# EAGLE design esquematico_trampa (EAGLE 8.0.1)
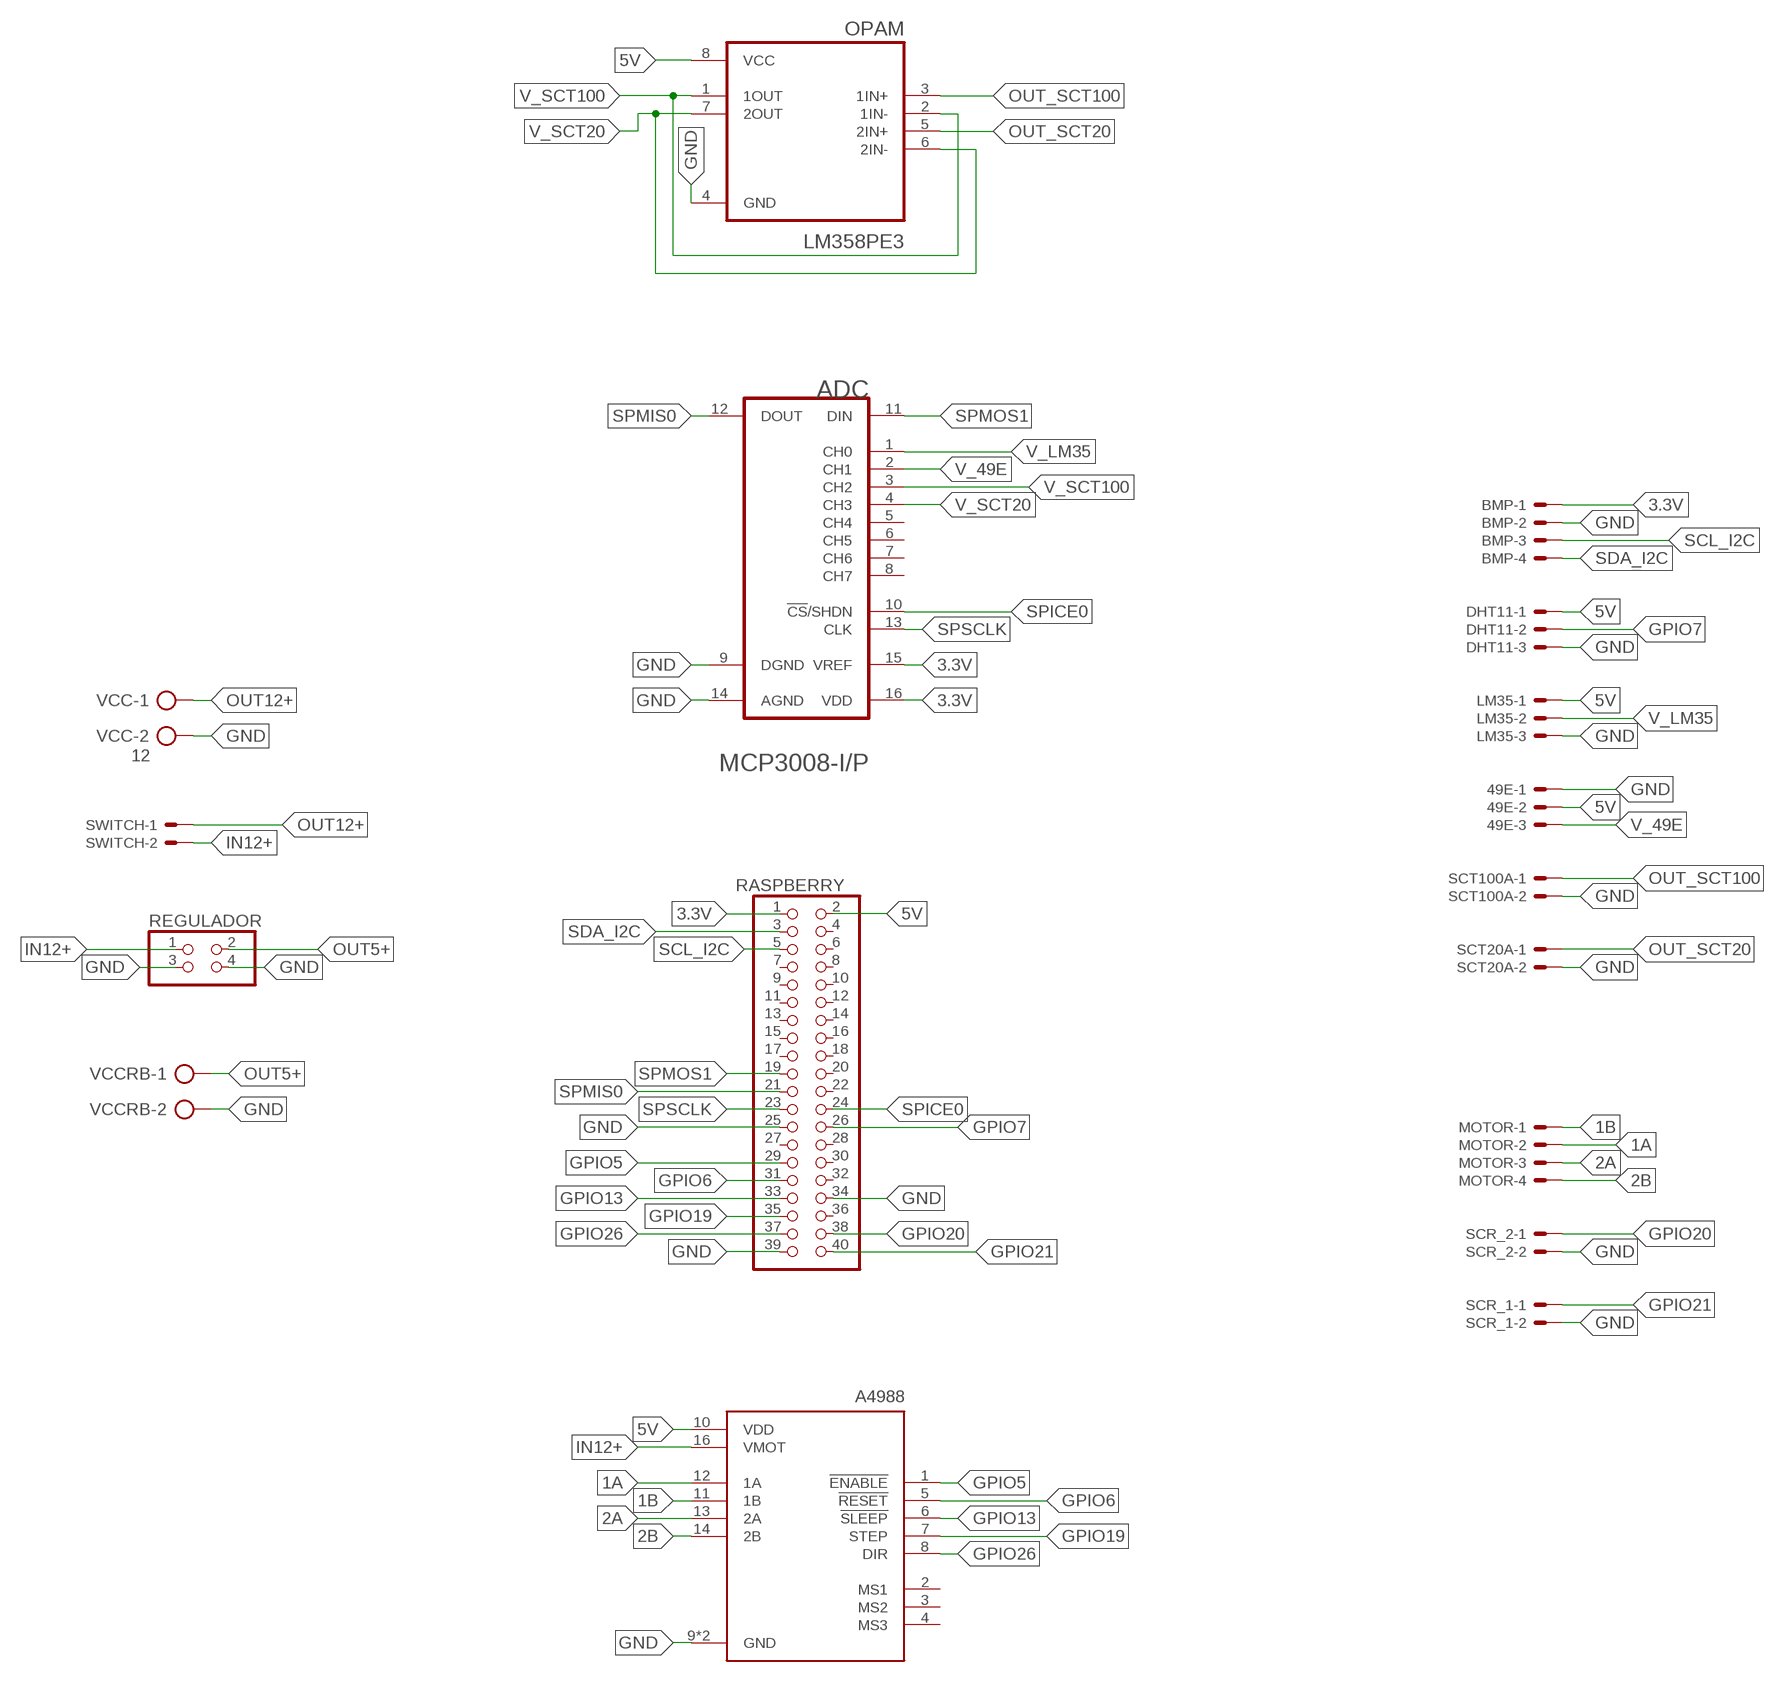
[diagram p0: schematic, sheet 1]

## Parts
49E  22-23-2031  [22-23-2031]
A4988  A4988_STEPPER_MOTOR_DRIVER_CARRIER  [MODULE_A4988_STEPPER_MOTOR_DRIVER_CARRIER]
ADC  MICROCHIP_MCP3008-I-PMICROCHIP_MCP3008-I-P_0_0  [MICROCHIP_MCP3008-I-P_0]
BMP  22-23-2041  [22-23-2041]
DHT11  22-23-2031  [22-23-2031]
LM35  22-23-2031  [22-23-2031]
MOTOR  22-23-2041  [22-23-2041]
OPAM  LM358PE3  [DIP794W45P254L959H508Q8]
RASPBERRY  PINHD-2X20  [2X20]
REGULADOR  PINHD-2X2  [2X02]
SCR_1  22-23-2021  [22-23-2021]
SCR_2  22-23-2021  [22-23-2021]
SCT20A  22-23-2021  [22-23-2021]
SCT100A  22-23-2021  [22-23-2021]
SWITCH  22-23-2021  [22-23-2021]
VCC  12  AK500/2-H  [AK500/2-H]
VCCRB  AK500/2-H  [AK500/2-H]

## Nets
1A: A4988.12(1A) MOTOR.2
1B: A4988.11(1B) MOTOR.1
2A: A4988.13(2A) MOTOR.3
2B: A4988.14(2B) MOTOR.4
3.3V: ADC.15(VREF) ADC.16(VDD) BMP.1 RASPBERRY.1
5V [VCC]: 49E.2 A4988.10(VDD) DHT11.1 LM35.1 OPAM.8(VCC) RASPBERRY.2
GND [VCC]: 49E.1 A4988.9(GND) A4988.15(GND) ADC.9(DGND) ADC.14(AGND) BMP.2 DHT11.3 LM35.3 OPAM.4(GND) RASPBERRY.25 RASPBERRY.34 RASPBERRY.39 REGULADOR.3 REGULADOR.4 SCR_1.2 SCR_2.2 SCT20A.2 SCT100A.2 VCC.2 VCCRB.2
GPIO5: A4988.1(!ENABLE) RASPBERRY.29
GPIO6: A4988.5(!RESET) RASPBERRY.31
GPIO7: DHT11.2 RASPBERRY.26
GPIO13: A4988.6(!SLEEP) RASPBERRY.33
GPIO19: A4988.7(STEP) RASPBERRY.35
GPIO20: RASPBERRY.38 SCR_2.1
GPIO21: RASPBERRY.40 SCR_1.1
GPIO26: A4988.8(DIR) RASPBERRY.37
IN12+ [VCC]: A4988.16(VMOT) REGULADOR.1 SWITCH.2
OUT5+ [VCC]: REGULADOR.2 VCCRB.1
OUT12+ [VCC]: SWITCH.1 VCC.1
OUT_SCT20: OPAM.5(2IN+) SCT20A.1
OUT_SCT100: OPAM.3(1IN+) SCT100A.1
SCL_I2C: BMP.3 RASPBERRY.5
SDA_I2C: BMP.4 RASPBERRY.3
SPICE0: ADC.10(!CS!/SHDN) RASPBERRY.24
SPMIS0: ADC.12(DOUT) RASPBERRY.21
SPMOS1: ADC.11(DIN) RASPBERRY.19
SPSCLK: ADC.13(CLK) RASPBERRY.23
V_49E: 49E.3 ADC.2(CH1)
V_LM35: ADC.1(CH0) LM35.2
V_SCT20: ADC.4(CH3) OPAM.6(2IN-) OPAM.7(2OUT)
V_SCT100: ADC.3(CH2) OPAM.1(1OUT) OPAM.2(1IN-)
Unconnected: A4988.2(MS1) A4988.3(MS2) A4988.4(MS3) ADC.5(CH4) ADC.6(CH5) ADC.7(CH6) ADC.8(CH7) RASPBERRY.4 RASPBERRY.6 RASPBERRY.7 RASPBERRY.8 RASPBERRY.9 RASPBERRY.10 RASPBERRY.11 RASPBERRY.12 RASPBERRY.13 RASPBERRY.14 RASPBERRY.15 RASPBERRY.16 RASPBERRY.17 RASPBERRY.18 RASPBERRY.20 RASPBERRY.22 RASPBERRY.27 RASPBERRY.28 RASPBERRY.30 RASPBERRY.32 RASPBERRY.36

## Library data of the parts
49E DHT11 LM35 = con-molex:22-23-2031: .100" (2.54mm) Center Header - 3 Pin; MF: MOLEX; MPN: 22-23-2031; OC_FARNELL: 1462950; OC_NEWARK: 30C0862
A4988 = A4988_STEPPER_MOTOR_DRIVER_CARRIER:A4988_STEPPER_MOTOR_DRIVER_CARRIER: Stepper motor controler; IC: A4988; 1A; Uin mot: 8÷35V Check availability <https://pricing.snapeda.com/parts/A4988%20STEPPER%20MOTOR%20DRIVER%20CARRIER/Pololu/view-part?ref=eda>; AVAILABILITY: Not in stock; DESCRIPTION: Stepper Motor Driver; MF: Pololu; MP: A4988 STEPPER MOTOR DRIVER CARRIER; PACKAGE: None; PRICE: None
ADC = P:MICROCHIP_MCP3008-I-P: CON-ADC-MCP3008-16; CIIVA_IDS: 1029167; CODE__JEDEC: MS-001-BB; COMPONENT_LINK_1_DESCRIPTION: Manufacturer URL; COMPONENT_LINK_1_URL: http://www.microchip.com/; COMPONENT_LINK_3_DESCRIPTION: Package Specification; COMPONENT_LINK_3_URL: http://www.microchip.com/stellent/groups/techpub_sg/documents/packagingspec/en012702.pdf; DATASHEET: http://ww1.microchip.com/downloads/en/DeviceDoc/21295d.pdf; DATASHEET_VERSION: revD, Dec-2008; FOOTPRINT_VARIANT_NAME_0: Manufacturer Recommended; IMPORTED: yes; IMPORTED_FROM: vault; IMPORT_TS: 1521858609; MF: Microchip; MPN: MCP3008-I/P; PACKAGE: PDIP300-P16; PACKAGE_DESCRIPTION: 16-Lead Plastic Dual In-Line (P) - 300 mil Body [PDIP]; PACKAGE_VERSION: revBB, Aug-2009; PIN_0_0_4_INSIDE_EDGE: clock; PREFIX: U; RELEASE_DATE: 1331947901; VAULT_GUID: 2915DD49-D9E5-42B8-8D13-7AC3BE91A6A7; VAULT_REVISION: 766F0992-63B6-4F6C-8EA7-A406CB97F150
BMP MOTOR = con-molex:22-23-2041: .100" (2.54mm) Center Header - 4 Pin; MF: MOLEX; MPN: 22-23-2041; OC_FARNELL: 1462920; OC_NEWARK: 38C0355
OPAM = LM358PE3:LM358PE3: Check availability <https://pricing.snapeda.com/parts/LM358PE3/Texas%20Instruments/view-part?ref=eda>; AVAILABILITY: In Stock; DESCRIPTION: Dual, 30-V, 700-kHz operational amplifier; MF: Texas Instruments; MP: LM358PE3; PACKAGE: PDIP-8 Texas; PRICE: None; PURCHASE-URL: https://pricing.snapeda.com/search/part/LM358PE3/?ref=eda
RASPBERRY = pinhead:PINHD-2X20: PIN HEADER
REGULADOR = pinhead:PINHD-2X2: PIN HEADER
SCR_1 SCR_2 SCT20A SCT100A SWITCH = con-molex:22-23-2021: .100" (2.54mm) Center Header - 2 Pin; MF: MOLEX; MPN: 22-23-2021; OC_FARNELL: 1462926; OC_NEWARK: 25C3832
VCC VCCRB = con-ptr500:AK500/2-H: CONNECTOR Aug. 2004 / PTR Meßtechnik: Die Bezeichnung der Serie AK505 wurde geändert. Es handelt sich hierbei um AK500 in horizontaler Ausführung.; OC_FARNELL: unknown; OC_NEWARK: unknown

## Net classes
0 Raspberry gpio: width 0.508 mm, drill 0.254 mm, clearance 0.254 mm
1 VCC: width 1.016 mm, drill 0.254 mm, clearance 0.254 mm

## Board
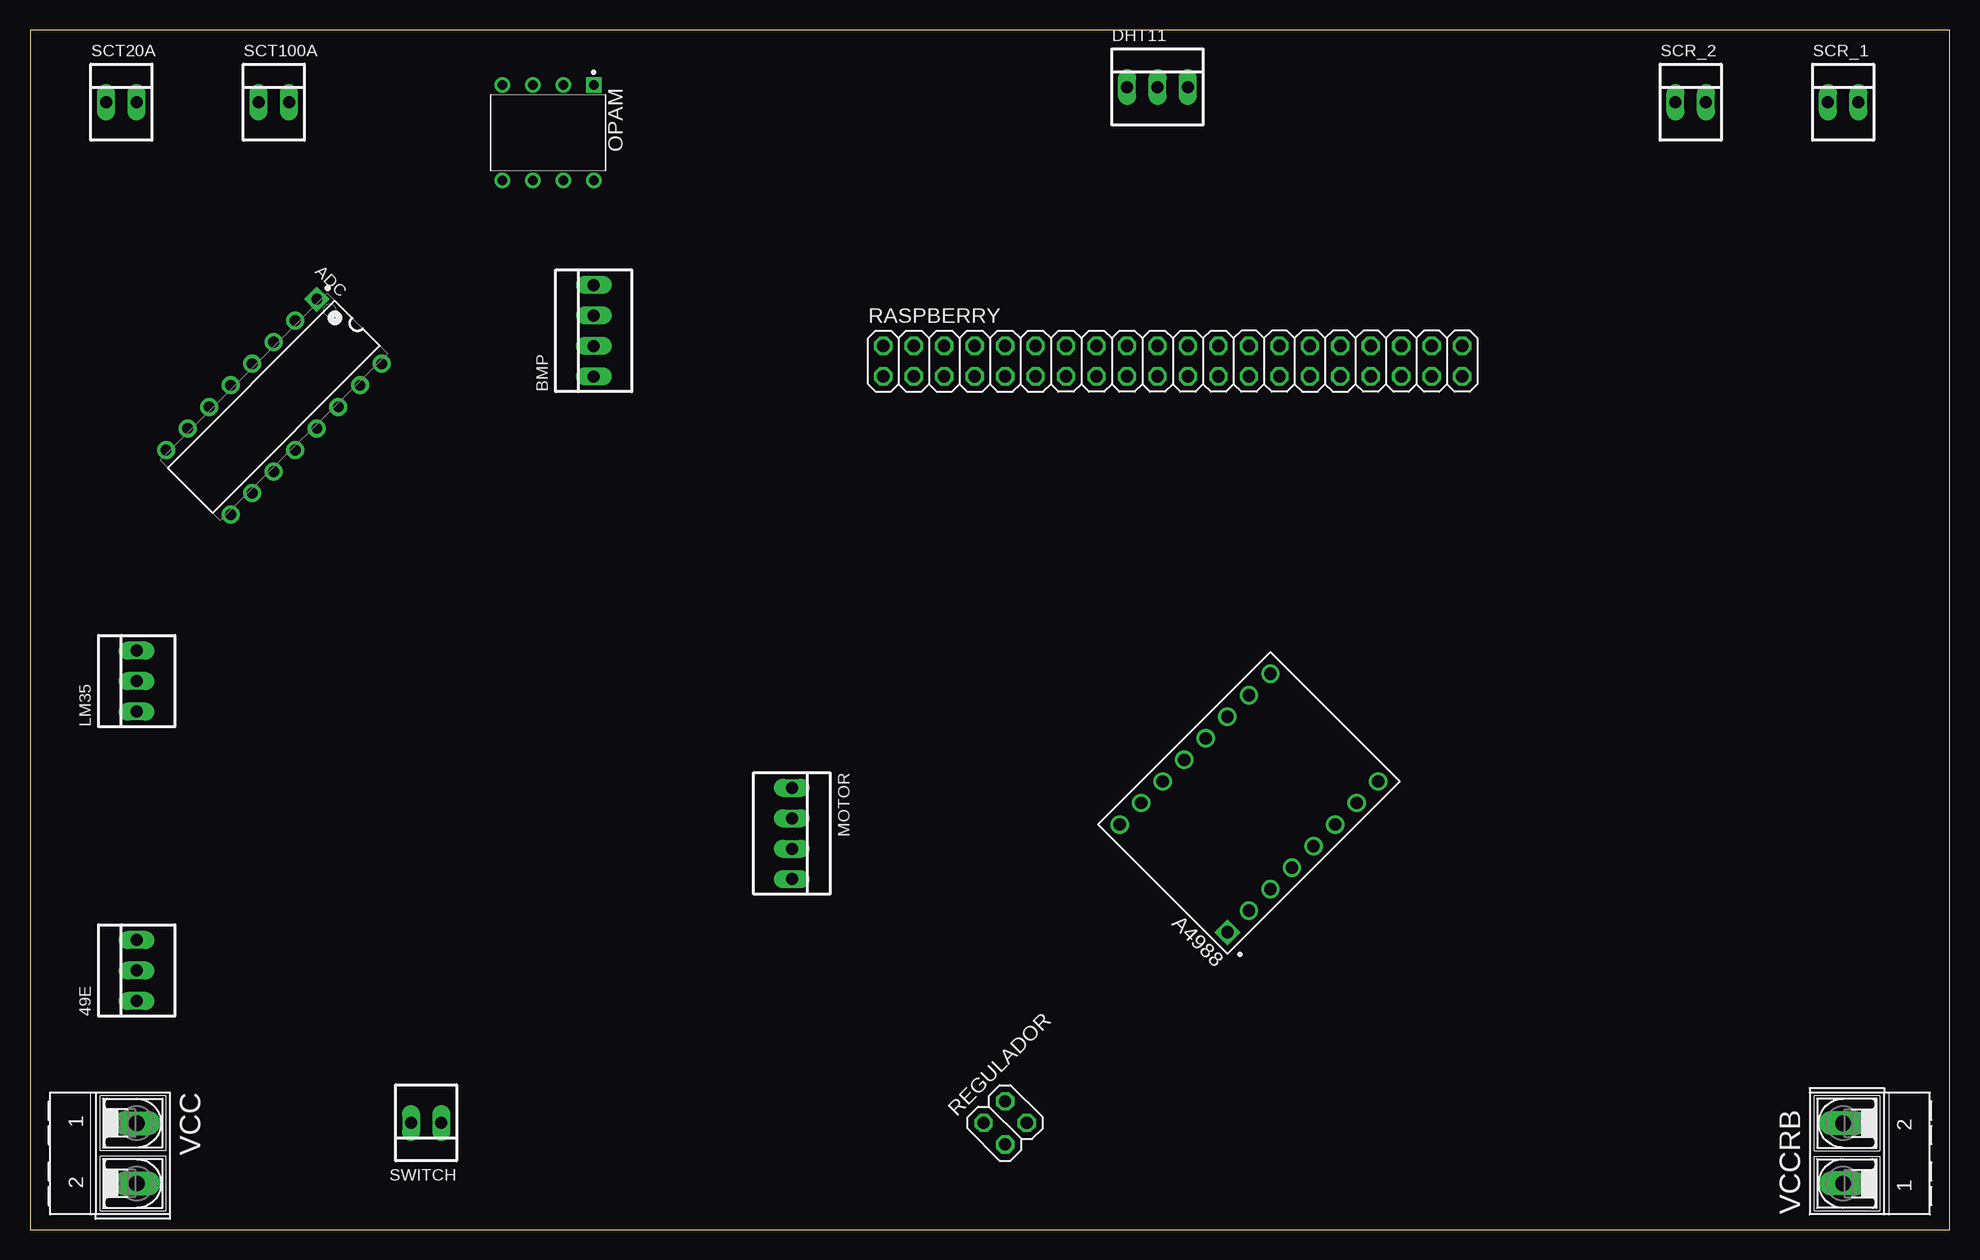
[diagram p1: board, top side]
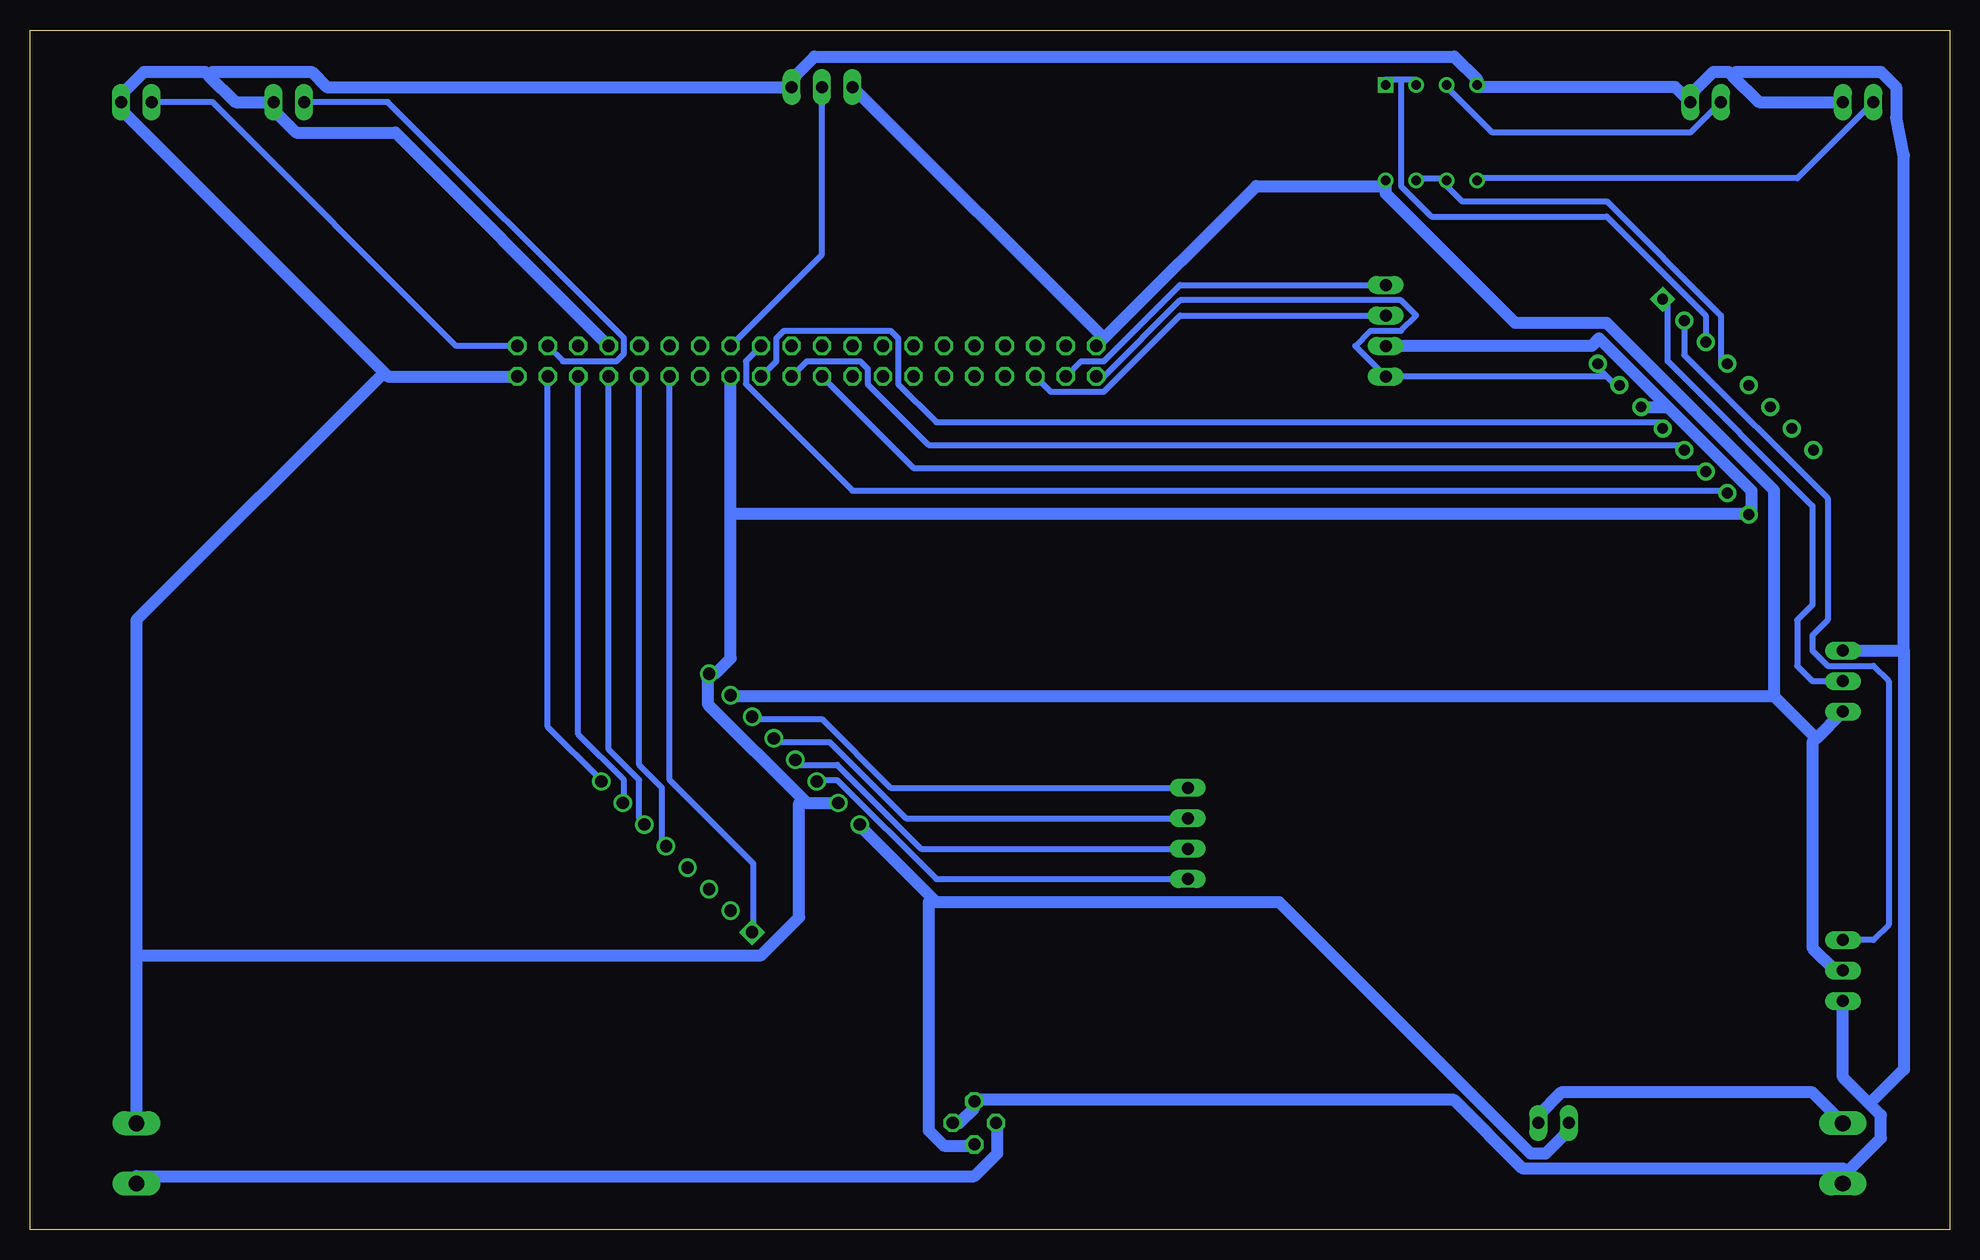
[diagram p2: board, bottom side, seen from below]

Size 160 x 100 mm. Coordinates in mm from the lower left corner, seen from the top.
Outline: 0,0 160,0 160,100 0,100 0,0
Copper layers (1*16): Top 0.035mm / dielectric 1.5mm / Bottom 0.035mm
Design rules "default": minimum track width 10mil, minimum drill 24mil, track to track 8mil, track to pad 8mil, pad to pad 8mil, via to via 8mil, smd to smd 8mil, copper to edge 40mil, drill to drill 8mil, minimum pad ring 10mil, minimum via ring 8mil, stop-mask expansion 4mil, vias tented up to drill 0mil, thermal gap 10mil

### Footprints (pad centres in the part's own frame; a part is rotated, then mirrored left to right if it is on the bottom)
22-23-2031 = drill 1 long: 1 -2.54,0; 2 0,0; 3 2.54,0
MODULE_A4988_STEPPER_MOTOR_DRIVER_CARRIER = drill 1.02 square: 1 -6.35,8.89 | drill 1.02: 2 -6.35,6.35; 3 -6.35,3.81; 4 -6.35,1.27; 5 -6.35,-1.27; 6 -6.35,-3.81; 7 -6.35,-6.35; 8 -6.35,-8.89; 9 6.35,-8.89; 10 6.35,-6.35; 11 6.35,-3.81; 12 6.35,-1.27; 13 6.35,1.27; 14 6.35,3.81; 15 6.35,6.35; 16 6.35,8.89
MICROCHIP_MCP3008-I-P_0 = drill 0.9 pad 1.5 square: 1 -3.81,8.89 | drill 0.9 pad 1.5: 2 -3.81,6.35; 3 -3.81,3.81; 4 -3.81,1.27; 5 -3.81,-1.27; 6 -3.81,-3.81; 7 -3.81,-6.35; 8 -3.81,-8.89; 9 3.81,-8.89; 10 3.81,-6.35; 11 3.81,-3.81; 12 3.81,-1.27; 13 3.81,1.27; 14 3.81,3.81; 15 3.81,6.35; 16 3.81,8.89
22-23-2041 = drill 1 long: 1 -3.81,0; 2 -1.27,0; 3 1.27,0; 4 3.81,0
DIP794W45P254L959H508Q8 = drill 0.78 pad 1.13 square: 1 -3.97,3.81 | drill 0.78 pad 1.13: 2 -3.97,1.27; 3 -3.97,-1.27; 4 -3.97,-3.81; 5 3.97,-3.81; 6 3.97,-1.27; 7 3.97,1.27; 8 3.97,3.81
2X20 = drill 1.016 octagon: 1 -24.13,-1.27; 2 -24.13,1.27; 3 -21.59,-1.27; 4 -21.59,1.27; 5 -19.05,-1.27; 6 -19.05,1.27; 7 -16.51,-1.27; 8 -16.51,1.27; 9 -13.97,-1.27; 10 -13.97,1.27; 11 -11.43,-1.27; 12 -11.43,1.27; 13 -8.89,-1.27; 14 -8.89,1.27; 15 -6.35,-1.27; 16 -6.35,1.27; 17 -3.81,-1.27; 18 -3.81,1.27; 19 -1.27,-1.27; 20 -1.27,1.27; 21 1.27,-1.27; 22 1.27,1.27; 23 3.81,-1.27; 24 3.81,1.27; 25 6.35,-1.27; 26 6.35,1.27; 27 8.89,-1.27; 28 8.89,1.27; 29 11.43,-1.27; 30 11.43,1.27; 31 13.97,-1.27; 32 13.97,1.27; 33 16.51,-1.27; 34 16.51,1.27; 35 19.05,-1.27; 36 19.05,1.27; 37 21.59,-1.27; 38 21.59,1.27; 39 24.13,-1.27; 40 24.13,1.27
2X02 = drill 1.016 octagon: 1 -1.27,-1.27; 2 -1.27,1.27; 3 1.27,-1.27; 4 1.27,1.27
22-23-2021 = drill 1 long: 1 -1.27,0; 2 1.27,0
AK500/2-H = drill 1.321 long: 1 -2.515,0; 2 2.515,0

### Placement (x,y rotation side)
49E  8.89,21.59 90 top
A4988  101.6,35.56 135 top
ADC  20.32,68.58 315 top
BMP  46.99,74.93 90 top
DHT11  93.98,95.25 0 top
LM35  8.89,45.72 90 top
MOTOR  63.5,33.02 270 top
OPAM  43.18,91.44 270 top
RASPBERRY  95.25,72.39 0 top
REGULADOR  81.28,8.89 45 top
SCR_1  151.13,93.98 0 top
SCR_2  138.43,93.98 0 top
SCT20A  7.62,93.98 0 top
SCT100A  20.32,93.98 0 top
SWITCH  33.02,8.89 180 top
VCC  8.89,6.35 270 top
VCCRB  151.13,6.35 90 top

### Tracks (layer width: path | path; a pad name or v marks a point on that pad's centre or on a via)
1A
  Bottom 0.508: MOTOR.2 87,34.29 93.34,40.64 97.79,40.64 A4988.12
1B
  Bottom 0.508: MOTOR.1 88.27,36.83 93.98,42.55 99.69,42.55 A4988.11
2A
  Bottom 0.508: MOTOR.3 85.72,31.75 92.71,38.73 95.89,38.73 A4988.13
2B
  Bottom 0.508: MOTOR.4 84.45,29.21 92.71,37.47 93.98,37.47 A4988.14
3.3V
  Bottom 0.508: 28.57,71.12 29.21,71.75 ADC.16 | 28.57,71.12 27.94,70.48 ADC.15 | 28.57,71.12 BMP.1 49.53,73.66 48.26,74.93 45.72,74.93 44.45,76.2 45.72,77.47 64.14,77.47 70.48,71.12 RASPBERRY.1
5V
  Bottom 1.016: 46.99,87 57.78,87 70.48,74.3 | RASPBERRY.2 70.48,74.3 | 70.48,74.3 DHT11.1 | 49E.2 9.53,21.59 11.43,23.5 11.43,40.64 11.11,40.96 | LM35.1 11.11,40.96 | 14.61,44.45 101.6,44.45 A4988.10 | 11.11,40.96 14.61,44.45 | 46.99,87 46.99,86.36 36.2,75.56 28.57,75.56 14.61,61.59 14.61,44.45 | 46.99,87 OPAM.8
GND
  Bottom 1.016: 23.5,68.58 16.51,61.59 16.51,59.69 ADC.9 17.14,59.69 101.6,59.69 | ADC.14 23.5,68.58 | BMP.2 29.84,73.66 29.21,74.3 23.5,68.58 | 101.6,59.69 101.6,47.62 102.87,46.35 A4988.9 103.5,45.72 103.5,43.81 95.57,35.88 | 101.6,59.69 RASPBERRY.25 | A4988.15 95.25,35.56 95.57,35.88 | REGULADOR.3 82.55,8.89 81.28,10.16 REGULADOR.4 81.28,10.79 41.27,10.79 35.56,5.08 8.89,5.08 8.57,4.76 | 49E.1 8.89,12.7 6.67,10.48 | 6.67,10.48 5.71,9.53 5.71,7.62 8.57,4.76 | 8.57,4.76 8.89,4.45 VCC.2 | 8.26,48.26 LM35.3 3.81,48.26 | 6.67,10.48 3.81,13.34 3.81,48.26 | SCT20A.2 15.88,93.98 18.1,96.2 | 18.1,96.2 18.41,96.52 19.68,96.52 21.59,94.61 SCT100A.2 22.86,95.25 39.37,95.25 OPAM.4 39.37,95.89 41.27,97.79 94.61,97.79 97.16,95.25 | 140.34,93.98 142.88,93.98 145.1,96.2 | 145.1,96.2 145.41,96.52 150.5,96.52 152.4,94.61 SCR_1.2 152.4,93.34 130.49,71.44 | 97.16,95.25 135.25,95.25 136.53,96.52 144.78,96.52 145.1,96.2 | RASPBERRY.34 129.54,91.44 137.79,91.44 140.34,93.98 | 140.34,93.98 SCR_2.2 | RASPBERRY.39 130.18,71.12 130.49,71.44 | 151.13,22.86 151.13,50.8 130.49,71.44 | 151.13,22.86 VCCRB.2 | 97.16,95.25 DHT11.3 | 18.1,96.2 17.78,96.52 5.71,96.52 4.45,95.25 4.45,92.71 3.81,89.53 3.81,48.26 | 151.13,22.86 99.06,22.86 95.89,26.04 95.89,35.56 95.57,35.88
GPIO5
  Bottom 0.508: RASPBERRY.29 106.68,37.47 99.69,30.48 99.69,25.4 A4988.1
GPIO6
  Bottom 0.508: RASPBERRY.31 109.22,38.73 107.31,36.83 107.31,32.38 A4988.5
GPIO7
  Bottom 0.508: DHT11.2 93.98,81.28 RASPBERRY.26
GPIO13
  Bottom 0.508: RASPBERRY.33 111.76,40.01 109.22,37.47 109.22,34.29 A4988.6
GPIO19
  Bottom 0.508: RASPBERRY.35 114.3,41.27 110.49,37.47 110.49,35.56 A4988.7
GPIO20
  Bottom 0.508: SCR_2.1 130.18,93.98 110.49,74.3 110.49,73.03 111.12,72.39 115.57,72.39 RASPBERRY.38
GPIO21
  Bottom 0.508: SCR_1.1 144.78,93.98 124.46,73.66 RASPBERRY.40
GPIO26
  Bottom 0.508: RASPBERRY.37 116.84,41.91 112.39,37.47 A4988.8
IN12+
  Bottom 1.016: SWITCH.2 31.75,8.26 33.66,6.35 34.92,6.35 55.88,27.3 84.45,27.3 84.77,27.62 | 84.77,27.62 90.81,33.66 A4988.16 | REGULADOR.1 81.28,6.99 83.82,6.99 85.09,8.26 85.09,27.3 84.77,27.62
OUT5+
  Bottom 1.016: REGULADOR.2 79.38,8.89 79.38,6.35 81.28,4.45 151.13,4.45 VCCRB.1
OUT12+
  Bottom 1.016: SWITCH.1 34.29,9.53 32.38,11.43 11.43,11.43 8.89,8.89 VCC.1
OUT_SCT20
  Bottom 0.508: SCT20A.1 12.7,87.63 39.37,87.63 OPAM.5
OUT_SCT100
  Bottom 0.508: SCT100A.1 21.59,91.44 38.1,91.44 41.91,95.25 OPAM.3
SCL_I2C
  Bottom 0.508: BMP.3 64.14,76.2 70.48,69.85 74.93,69.85 RASPBERRY.5
SDA_I2C
  Bottom 0.508: BMP.4 64.14,78.74 70.48,72.39 72.39,72.39 RASPBERRY.3
SPICE0
  Bottom 0.508: RASPBERRY.24 100.33,72.39 100.33,70.48 91.44,61.59 19.05,61.59 ADC.10
SPMIS0
  Bottom 0.508: RASPBERRY.21 95.25,72.39 90.81,72.39 90.17,71.75 90.17,70.48 85.09,65.41 22.23,65.41 ADC.12
SPMOS1
  Bottom 0.508: RASPBERRY.19 86.36,63.5 20.32,63.5 ADC.11
SPSCLK
  Bottom 0.508: RASPBERRY.23 97.79,72.39 97.79,74.3 97.16,74.93 88.27,74.93 87.63,74.3 87.63,70.48 84.45,67.31 24.13,67.31 ADC.13
V_49E
  Bottom 0.508: ADC.2 22.12,72.92 10.16,60.96 10.16,50.8 11.43,49.53 11.43,48.26 10.16,46.99 6.35,46.99 5.08,45.72 5.08,25.4 6.35,24.13 49E.3
V_LM35
  Bottom 0.508: ADC.1 23.5,77.47 23.5,72.39 11.43,60.33 11.43,52.07 12.7,50.8 12.7,46.99 11.43,45.72 LM35.2
V_SCT20
  Bottom 0.508: OPAM.7 44.45,87.63 41.91,87.63 OPAM.6 41.91,87 40.64,85.72 28.57,85.72 19.05,76.2 19.05,72.39 ADC.4
V_SCT100
  Bottom 0.508: 45.72,95.89 46.99,95.89 OPAM.1 | 45.72,95.89 44.45,95.89 OPAM.2 | ADC.3 20.32,76.2 28.57,84.45 43.18,84.45 45.72,87 45.72,95.89